# Altium schematic sheet edge_dff_clk_high.SchDoc
size A4
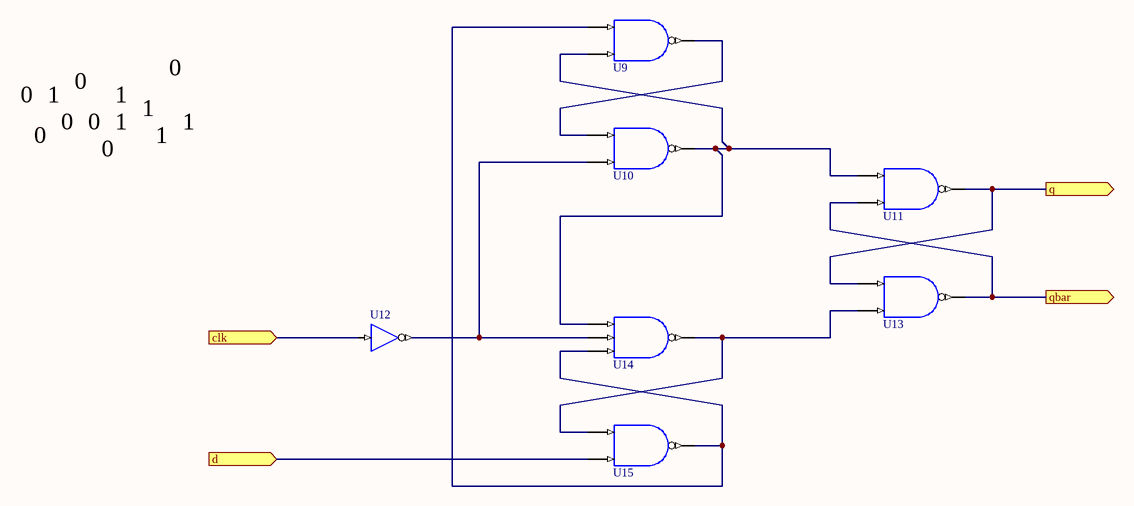
[diagram p0: edge_dff_clk_high.SchDoc]

## Parts
U9  AND 2  (value not drawn)
U10  AND 2  (value not drawn)
U11  AND 2  (value not drawn)
U12  BUF_inv  (value not drawn)
U13  AND 2  (value not drawn)
U14  NAND_3  (value not drawn)
U15  AND 2  (value not drawn)

## Ports
clk (in), d (in), q (out), qbar (out)

## Nets
clk: U12.I ; port clk
d: U15.B ; port d
q: U11.Y U13.A ; port q
qbar: U11.B U13.Y ; port qbar
NetU9_A: U9.A U14.C U15.Y
NetU9_B: U9.B U10.Y U11.A U14.A
NetU9_Y: U9.Y U10.A
NetU10_B: U10.B U12.O U14.B
NetU13_B: U13.B U14.Y U15.A

## Notes on the sheet
- 0
- 1

## Library data of the parts
U9-U11 U13 U15 = AND_2: 2 Input AND
U12 = BUF_inv: 1-bit General Purpose (Non-inverting) Buffer
U14 = NAND_3: 3 Input NAND 1 Not